# Altium schematic sheet LM60.SchDoc: 24-bit Analog to Digital converter
size A4; Author: Grzegorz Gajoch; DocumentNumber: 6; SheetNumber: 6; SheetTotal: 16; Model: EM1; PageSetup: Record=PageOptions|CenterHorizontal=True|CenterVertical=True|PrintScale=0.52|XCorrection=1.00|YCorrection=1.00|PrintKind=1|BorderSize=5000000|LeftOffset=0|BottomOffset=0|Orientation=2|PaperLength=4200|PaperWidth=2970|Scale=100|PaperSource=7|PrintQuality=600|MediaType=1|DitherType=10|PaperKind=A3|PrintScaleMode=1
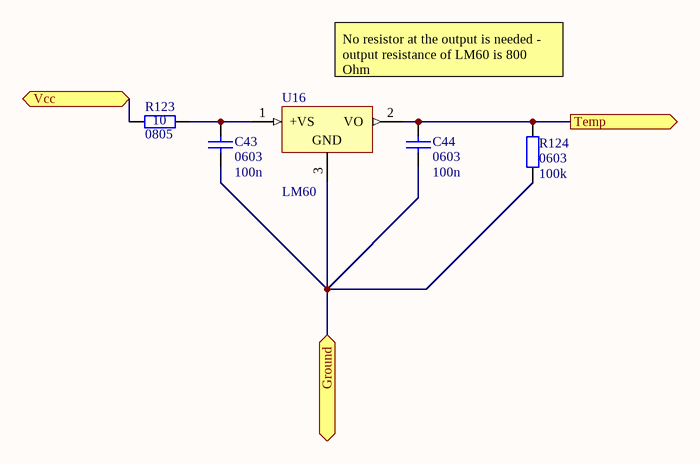
[diagram p0: LM60.SchDoc]

## Parts
C43  0603  value 100n  [SMD_Capacitor_0603]
C44  0603  value 100n  [SMD_Capacitor_0603]
R123  0805  value 10  [SMD_Resistor_0805]
R124  0603  value 100k  [SMD_Resistor_0603]
U16  LM60  [SOT23-3]

## Ports
Ground, Temp (out), Vcc

## Nets
Ground: C43.1 C44.1 R124.1 U16.3(GND) ; port Ground
Temp: C44.2 R124.2 U16.2(VO) ; port Temp
Vcc: R123.1 ; port Vcc
NetC43_2: C43.2 R123.2 U16.1(+VS)

## Notes on the sheet
- No resistor at the output is needed - output resistance of LM60 is 800 Ohm
- Title:
- Sheet:
- of
- Author:
- Model:
- Document Number:
- Checked by:
- Iss-Rev:
- Approved by:
- Date:
- File name:

## Library data of the parts
C43 C44 = Cap: Capacitor; Published: 8-Jun-2000; LatestRevisionDate: 17-Jul-2002; LatestRevisionNote: Re-released for DXP Platform.; PackageReference: RAD-0.3; Publisher: Altium Limited; PackageDescription: Radial Cap, Thru-Hole; 2 Leads; 0.3 in Pin Spacing
R123 R124 = Res2: Resistor; Published: 8-Jun-2000; LatestRevisionDate: 17-Jul-2002; LatestRevisionNote: Re-released for DXP Platform.; PackageReference: AXIAL-0.4; Publisher: Altium Limited; PackageDescription: Axial Device, Thru-Hole; 2 Leads; 0.4 in Pin Spacing
U16 = LM60: Analog temperature sensor